# EAGLE schematic Wire Schematic (EAGLE 9.6.2)
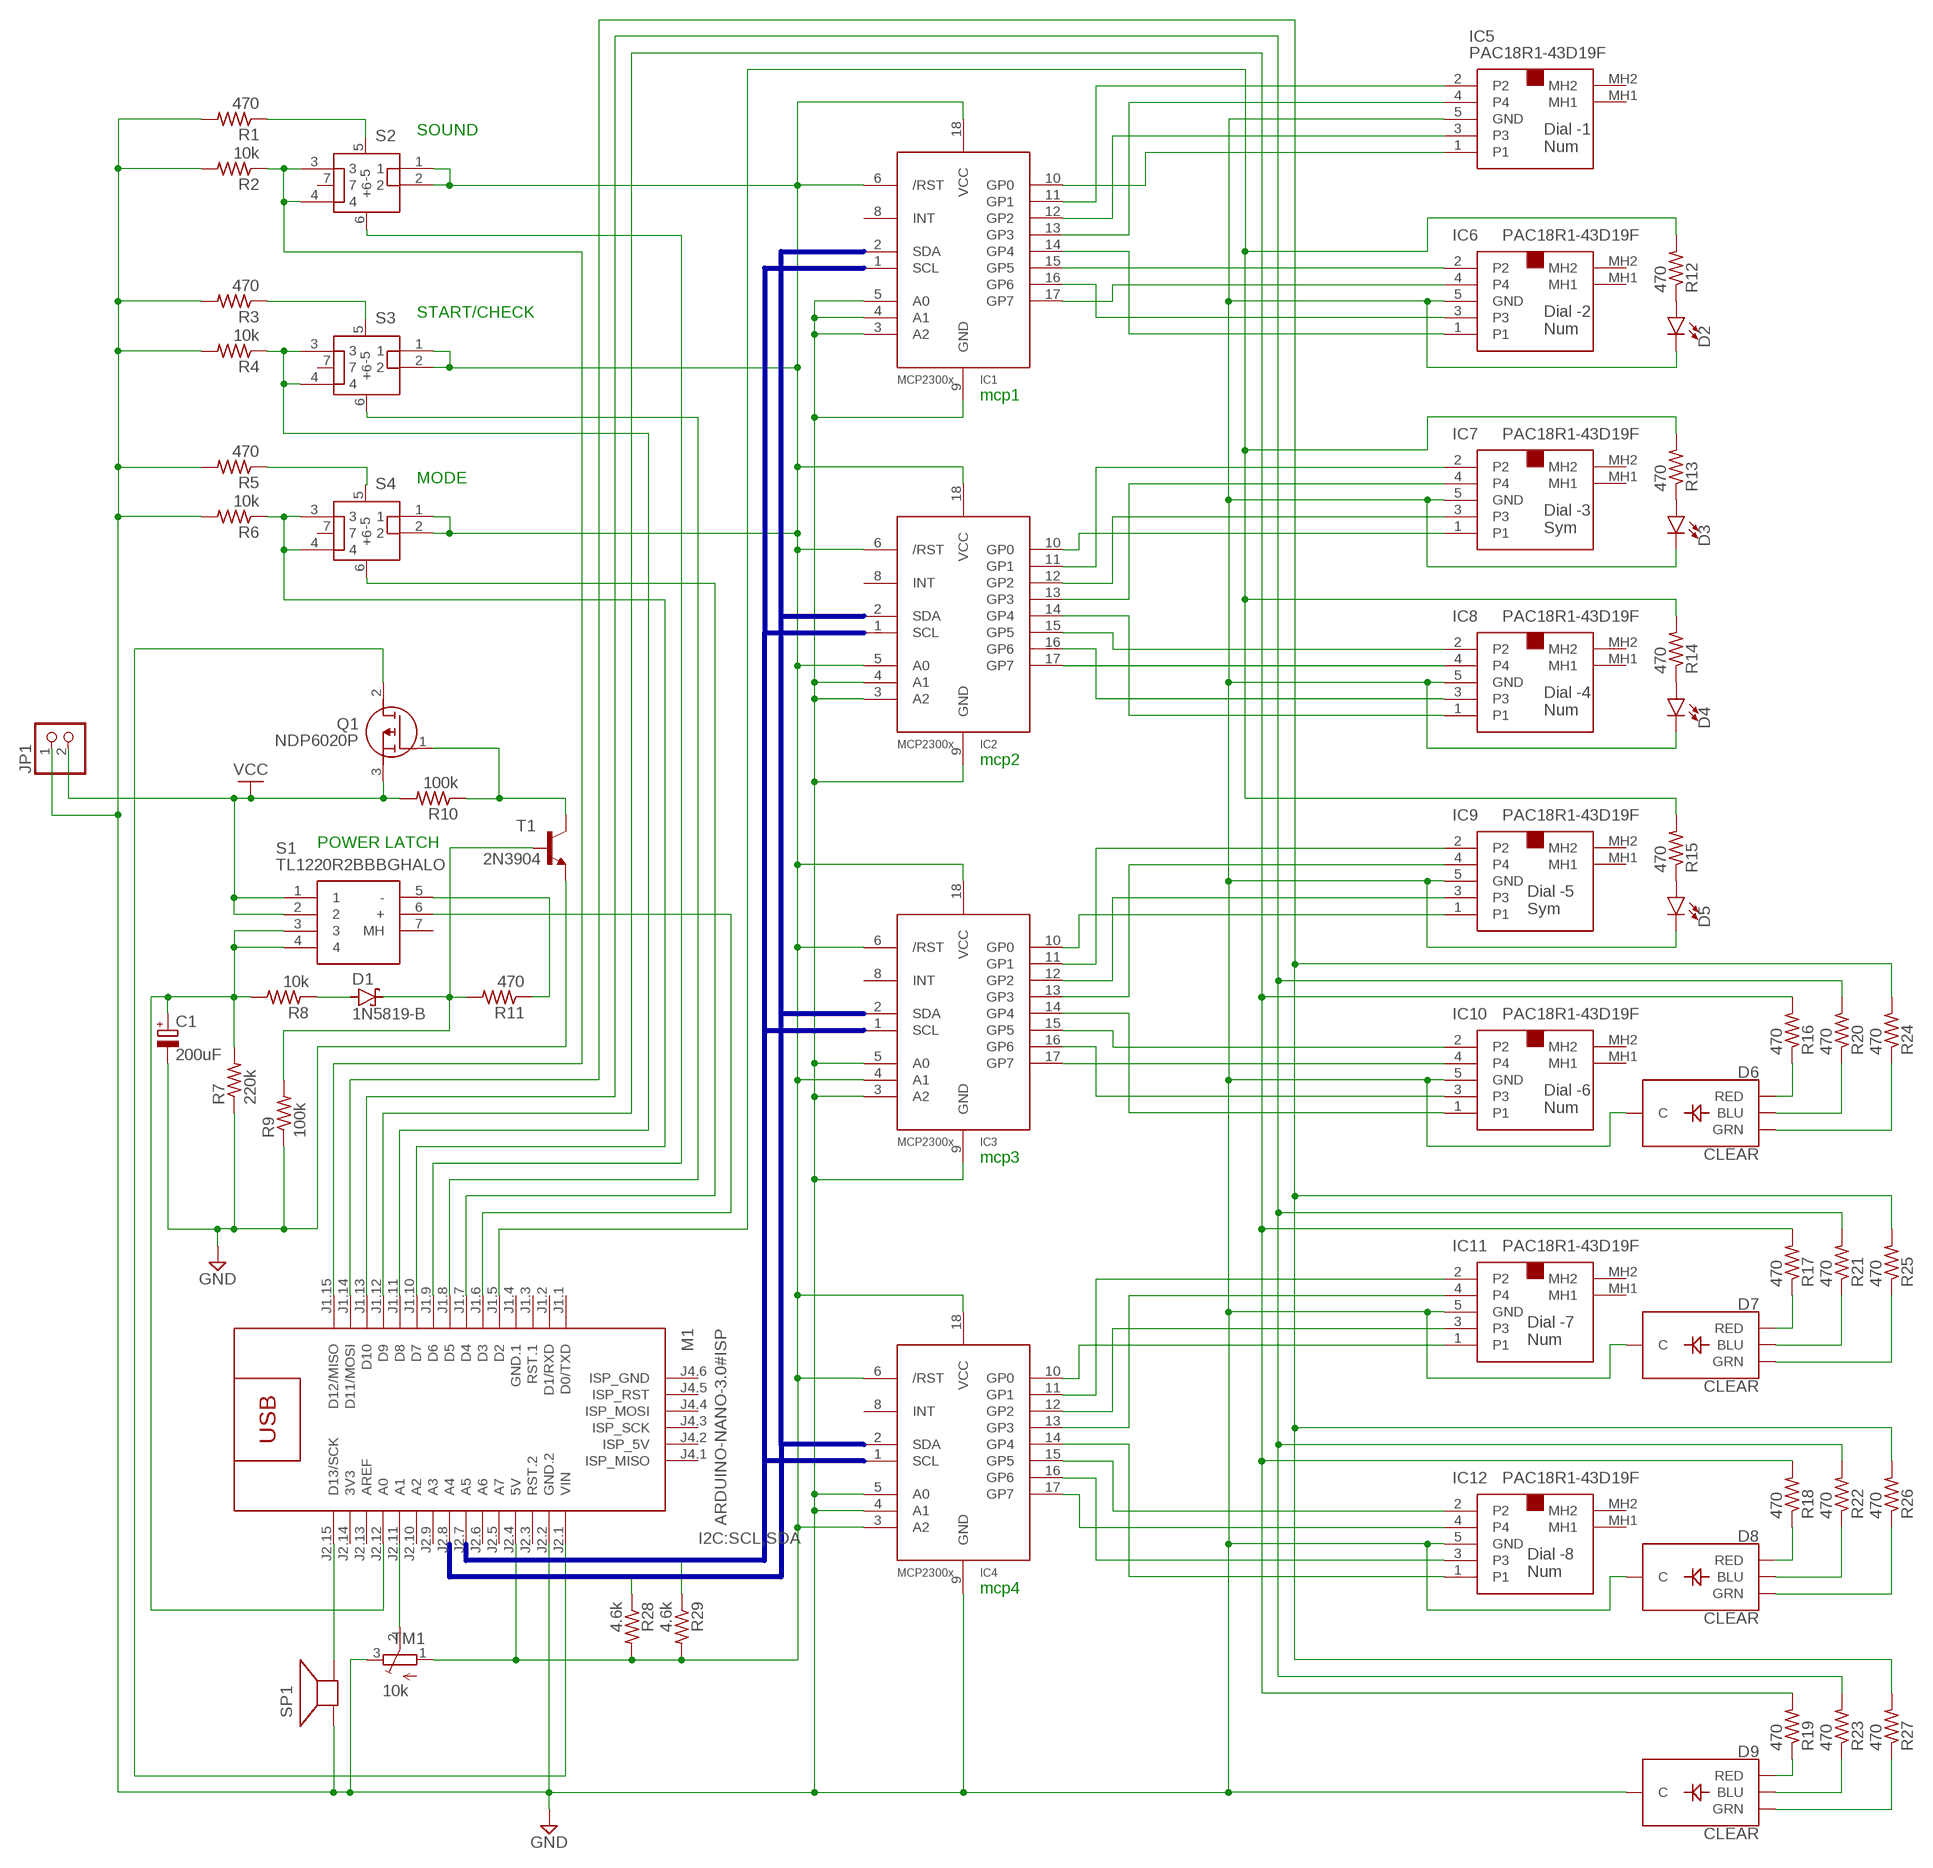
[diagram p0: schematic, sheet 1]

## Parts
C1  200uF  CPOL-EUE2.5-7  [E2,5-7]
D1  1N5819-B  [DO41-7.6]
D2  LED5MM  [LED_5MM]
D3  LED5MM  [LED_5MM]
D4  LED5MM  [LED_5MM]
D5  LED5MM  [LED_5MM]
D6  CLEAR  LED-RGB-CCCLEAR  [LED-RGB-THRU]
D7  CLEAR  LED-RGB-CCCLEAR  [LED-RGB-THRU]
D8  CLEAR  LED-RGB-CCCLEAR  [LED-RGB-THRU]
D9  CLEAR  LED-RGB-CCCLEAR  [LED-RGB-THRU]
IC1  MCP23008/P  [DIL18]
IC2  MCP23008/P  [DIL18]
IC3  MCP23008/P  [DIL18]
IC4  MCP23008/P  [DIL18]
IC5  PAC18R1-43D19F  [PAC18R141D19F]
IC6  PAC18R1-43D19F  [PAC18R141D19F]
IC7  PAC18R1-43D19F  [PAC18R141D19F]
IC8  PAC18R1-43D19F  [PAC18R141D19F]
IC9  PAC18R1-43D19F  [PAC18R141D19F]
IC10  PAC18R1-43D19F  [PAC18R141D19F]
IC11  PAC18R1-43D19F  [PAC18R141D19F]
IC12  PAC18R1-43D19F  [PAC18R141D19F]
JP1  PINHD-1X2  [1X02]
M1  ARDUINO-NANO-3.0#ISP  [ARDUINO-NANO-3.0#ISP]
Q1  NDP6020P  [TO254P470X1016X2019-3P]
R1  470  R-US_0204/5  [0204/5]
R2  10k  R-US_0204/5  [0204/5]
R3  470  R-US_0204/5  [0204/5]
R4  10k  R-US_0204/5  [0204/5]
R5  470  R-US_0204/5  [0204/5]
R6  10k  R-US_0204/5  [0204/5]
R7  220k  R-US_0204/5  [0204/5]
R8  10k  R-US_0204/5  [0204/5]
R9  100k  R-US_0204/5  [0204/5]
R10  100k  R-US_0204/5  [0204/5]
R11  470  R-US_0204/5  [0204/5]
R12  470  R-US_0204/5  [0204/5]
R13  470  R-US_0204/5  [0204/5]
R14  470  R-US_0204/5  [0204/5]
R15  470  R-US_0204/5  [0204/5]
R16  470  R-US_0204/5  [0204/5]
R17  470  R-US_0204/5  [0204/5]
R18  470  R-US_0204/5  [0204/5]
R19  470  R-US_0204/5  [0204/5]
R20  470  R-US_0204/5  [0204/5]
R21  470  R-US_0204/5  [0204/5]
R22  470  R-US_0204/5  [0204/5]
R23  470  R-US_0204/5  [0204/5]
R24  470  R-US_0204/5  [0204/5]
R25  470  R-US_0204/5  [0204/5]
R26  470  R-US_0204/5  [0204/5]
R27  470  R-US_0204/5  [0204/5]
R28  4.6k  R-US_0204/5  [0204/5]
R29  4.6k  R-US_0204/5  [0204/5]
S1  TL1220R2BBBGHALO  [TL1220R2BBBGHALO]
S2  TL1220R2BBBBHALO  [TL1220R2BBBBHALO]
S3  TL1220R2BBBBHALO  [TL1220R2BBBBHALO]
S4  TL1220R2BBBBHALO  [TL1220R2BBBBHALO]
SP1  SPEAKER/AL60P  [AL60P]
T1  2N3904  [TO92]
TM1  10k  TRIMPOT3386  [TRIM-3386]

## Nets
GND: C1.- D2.K(C) D3.K(C) D4.K(C) D5.K(C) D6.2(C) D7.2(C) D8.2(C) D9.2(C) IC1.3(A2) IC1.4(A1) IC1.5(A0) IC1.9(GND) IC2.3(A2) IC2.4(A1) IC2.9(GND) IC3.3(A2) IC3.5(A0) IC3.9(GND) IC4.4(A1) IC4.5(A0) IC4.9(GND) IC5.5(GND) IC6.5(GND) IC7.5(GND) IC8.5(GND) IC9.5(GND) IC10.5(GND) IC11.5(GND) IC12.5(GND) JP1.1 M1.J2.2(GND.2) R1.2 R2.2 R3.2 R4.2 R5.2 R6.2 R7.1 R9.1 SP1.1(+) T1.3(E) TM1.3(E)
N$1: IC1.11(GP1) IC5.2
N$2: IC1.10(GP0) IC5.1
N$3: IC1.13(GP3) IC5.4
N$4: IC1.12(GP2) IC5.3
N$5: IC1.17(GP7) IC6.4
N$6: M1.J2.1(VIN) Q1.2(D)
N$7: M1.J2.11(A1) TM1.2(S)
N$8: IC1.14(GP4) IC6.1
N$9: IC3.15(GP5) IC10.2
N$10: IC1.15(GP5) IC6.2
N$11: IC1.16(GP6) IC6.3
N$12: IC2.14(GP4) IC8.1
N$13: IC2.15(GP5) IC8.2
N$14: IC2.16(GP6) IC8.3
N$15: IC2.11(GP1) IC7.2
N$17: IC2.13(GP3) IC7.4
N$18: IC1.6(/RST) IC1.18(VCC) IC2.5(A0) IC2.6(/RST) IC2.18(VCC) IC3.4(A1) IC3.6(/RST) IC3.18(VCC) IC4.3(A2) IC4.6(/RST) IC4.18(VCC) M1.J2.4(5V) R28.2 R29.2 S2.1 S2.2 S3.1 S3.2 S4.1 S4.2 TM1.1(A)
N$19: IC2.10(GP0) IC7.1
N$20: IC2.12(GP2) IC7.3
N$21: IC2.17(GP7) IC8.4
N$22: M1.J1.11(D8) R4.1 S3.3 S3.4
N$23: IC3.14(GP4) IC10.1
N$24: M1.J1.13(D10) R20.2 R21.2 R22.2 R23.2
N$25: IC3.16(GP6) IC10.3
N$26: IC3.11(GP1) IC9.2
N$27: IC3.13(GP3) IC9.4
N$28: R11.1 S1.5(-)
N$29: IC3.10(GP0) IC9.1
N$30: IC3.12(GP2) IC9.3
N$31: IC3.17(GP7) IC10.4
N$32: M1.J1.8(D5) S3.6(+6)
N$33: M1.J1.6(D3) S1.6(+)
N$34: IC4.14(GP4) IC12.1
N$35: IC4.15(GP5) IC12.2
N$36: IC4.16(GP6) IC12.3
N$37: IC4.11(GP1) IC11.2
N$38: IC4.13(GP3) IC11.4
N$39: D1.A R8.1
N$40: IC4.10(GP0) IC11.1
N$41: IC4.12(GP2) IC11.3
N$42: IC4.17(GP7) IC12.4
N$44: M1.J1.9(D6) S2.6(+6)
N$45: Q1.1(G) R10.1 T1.1(C)
N$46: M1.J1.7(D4) S4.6(+6)
N$47: D3.A R13.1
N$48: D4.A R14.1
N$49: C1.+ M1.J2.12(A0) R7.2 R8.2 S1.3 S1.4
N$51: D5.A R15.1
N$52: M1.J1.5(D2) R12.2 R13.2 R14.2 R15.2
N$53: D1.C R9.2 R11.2 T1.2(B)
N$55: M1.J1.12(D9) R16.2 R17.2 R18.2 R19.2
N$56: M1.J2.15(D13/SCK) SP1.2(-)
N$61: D6.1(RED) R16.1
N$64: D6.4(BLU) R20.1
N$65: M1.J1.10(D7) R6.1 S4.3 S4.4
N$66: D2.A R12.1
N$67: D6.3(GRN) R24.1
N$68: R5.1 S4.5(-5)
N$70: R3.1 S3.5(-5)
N$71: R1.1 S2.5(-5)
N$72: M1.J1.15(D12/MISO) R2.1 S2.3 S2.4
N$80: D7.1(RED) R17.1
N$81: D7.4(BLU) R21.1
N$82: D7.3(GRN) R25.1
N$86: D8.1(RED) R18.1
N$87: D8.4(BLU) R22.1
N$88: D8.3(GRN) R26.1
N$90: M1.J1.14(D11/MOSI) R24.2 R25.2 R26.2 R27.2
N$92: D9.1(RED) R19.1
N$93: D9.4(BLU) R23.1
N$94: D9.3(GRN) R27.1
SCL: R29.1
SDA: R28.1
VCC: JP1.2 Q1.3(S) R10.2 S1.1 S1.2
Unconnected: IC1.1(SCL) IC1.2(SDA) IC1.8(INT) IC2.1(SCL) IC2.2(SDA) IC2.8(INT) IC3.1(SCL) IC3.2(SDA) IC3.8(INT) IC4.1(SCL) IC4.2(SDA) IC4.8(INT) IC5.MH1 IC5.MH2 IC6.MH1 IC6.MH2 IC7.MH1 IC7.MH2 IC8.MH1 IC8.MH2 IC9.MH1 IC9.MH2 IC10.MH1 IC10.MH2 IC11.MH1 IC11.MH2 IC12.MH1 IC12.MH2 M1.J1.1(D0/TXD) M1.J1.2(D1/RXD) M1.J1.3(RST.1) M1.J2.3(RST.2) M1.J2.5(A7) M1.J2.6(A6) M1.J2.7(A5) M1.J2.8(A4) M1.J2.9(A3) M1.J2.10(A2) M1.J2.13(AREF) M1.J4.1(ISP_MISO) M1.J4.2(ISP_5V) M1.J4.3(ISP_SCK) M1.J4.4(ISP_MOSI) M1.J4.5(ISP_RST) M1.J4.6(ISP_GND) S1.7(MH) S2.7 S3.7 S4.7

## Buses
I2C:SCL,SDA

## Notes on the sheet
- SOUND
- Dial -1
  Num
- START/CHECK
- Dial -2
  Num
- mcp1
- MODE
- Dial -3
  Sym
- Dial -4
  Num
- mcp2
- POWER LATCH
- Dial -5
  Sym
- Dial -6
  Num
- mcp3
- Dial -7
  Num
- Dial -8
  Num
- mcp4

## Power pins joined to a net without a drawn wire
3V3: M1.J2.14(3V3)
GND.1: M1.J1.4(GND.1)

## Library data of the parts
C1 = rcl:CPOL-EU: POLARIZED CAPACITOR, European symbol; SPICEPREFIX: C
D1 = diode:1N581*: 1.0A SCHOTTKY BARRIER RECTIFIER Source: http://www.diodes.com/datasheets/ds23001.pdf
D2-D5 = SparkFun-LED:LED: LED (Generic) Standard schematic elements and footprints for 5mm, 3mm, 1206, and 0603 sized LEDs. Generic LEDs with no color specified.
D6-D9 = SparkFun-LED:LED-RGB-CC: LED-RGB Common Cathode Packages: LED RGB-THRU LED_PIRANHA_5MM SparkFun Products: RGB Diffused Common Cathode- Diffuse <[https://www.sparkfun.com/products/9264]> RGB Diffused Common Cathode - Clear <[https://www.sparkfun.com/products/105]> LED-RGB 5mm Square (Piranha) <[https://www.sparkfun.com/products/11679]>; PROD_ID: DIO-08418
IC1-IC4 = adafruit:MCP23008: MCP23008 Inexpensive i2c i/o expander - 8 general purpose i/o pins with optional pullups
IC5-IC12 = Gregs:PAC18R1-43D19F: 18 mm Low Profile Absolute Encoder Source: Datasheet <https://media.digikey.com/pdf/Data Sheets/Bourns PDFs/PAC18R_Series_DS.pdf>; DESCRIPTION: 18 mm Low Profile Absolute Encoder; HEIGHT: 29.2mm; MANUFACTURER_NAME: Bourns; MANUFACTURER_PART_NUMBER: PAC18R1-43D19F; MOUSER_PART_NUMBER: 652-PAC18R1-43D19F; MOUSER_PRICE-STOCK: https://www.mouser.co.uk/ProductDetail/Bourns/PAC18R1-43D19F?qs=IS%252B4QmGtzzoiPnRwlkZJXA%3D%3D
JP1 = pinhead:PINHD-1X2: PIN HEADER
M1 = diy-modules:ARDUINO-NANO-3.0#ISP: Arduino Nano 3.0 with ISP pads
Q1 = SamacSys_Parts:NDP6020P: P-Channel MOSFET, 24 A, 20 V, 3-Pin TO-220 ON Semiconductor NDP6020P Source: Datasheet <https://www.onsemi.com/pub/Collateral/NDP6020P-D.PDF>; DESCRIPTION: P-Channel MOSFET, 24 A, 20 V, 3-Pin TO-220 ON Semiconductor NDP6020P; HEIGHT: 4.7mm; MANUFACTURER_NAME: ON Semiconductor; MANUFACTURER_PART_NUMBER: NDP6020P; MOUSER_PART_NUMBER: 512-NDP6020P; MOUSER_PRICE-STOCK: https://www.mouser.co.uk/ProductDetail/ON-Semiconductor-Fairchild/NDP6020P?qs=mdiO5HdF0Khl%252BuaDKGopOw%3D%3D
R1-R29 = adafruit:R-US_: RESISTOR, American symbol
S1 = SamacSys_Parts:TL1220R2BBBGHALO: Illuminated Tactile Switches Illuminated Multi-Option Tact Switch 50mA 12VDC 100m @ 1.5 VDC Max -40 C to 85 C 180 gf 50gf SPST 8.0mm dia button with black bezel, black button, Green LED Halo Source: Datasheet; DESCRIPTION: Illuminated Tactile Switches Illuminated Multi-Option Tact Switch 50mA 12VDC 100m @ 1.5 VDC Max -40 C to 85 C 180 gf 50gf SPST 8.0mm dia button with black bezel, black button, Green LED Halo; HEIGHT: 9mm; MANUFACTURER_NAME: E-Switch; MANUFACTURER_PART_NUMBER: TL1220R2BBBGHALO; MOUSER_PART_NUMBER: 612-TL1220R2BBBGHALO; MOUSER_PRICE-STOCK: https://www.mouser.co.uk/ProductDetail/E-Switch/TL1220R2BBBGHALO?qs=xQzBpF%2FAFTopKldGf8o7KQ%3D%3D
S2-S4 = Gregs:TL1220R2BBBBHALO: Tactile Switches Illuminated Multi-Option Tact Switch 50mA 12VDC 100m @ 1.5 VDC Max -40 C to 85 C 180 gf 50gf SPST 8.0mm dia button with black bezel, black button, Blue LED Halo Source: Datasheet <https://componentsearchengine.com/Datasheets/1/TL1220R2BBBBHALO.pdf>; DESCRIPTION: Tactile Switches Illuminated Multi-Option Tact Switch 50mA 12VDC 100m @ 1.5 VDC Max -40 C to 85 C 180 gf 50gf SPST 8.0mm dia button with black bezel, black button, Blue LED Halo; HEIGHT: 9.9mm; MANUFACTURER_NAME: E-Switch; MANUFACTURER_PART_NUMBER: TL1220R2BBBBHALO; MOUSER_PART_NUMBER: 612-TL1220R2BBBBHALO; MOUSER_PRICE-STOCK: https://www.mouser.co.uk/ProductDetail/E-Switch/TL1220R2BBBBHALO/?qs=xQzBpF%2FAFTqtthic0z3ctg%3D%3D
SP1 = adafruit:SPEAKER: SPEAKER Source: Buerklin Added PS12 (for part # PS1240 piezo) http://www.ladyada.net/library/pcb/eaglelibrary.html
T1 = transistor:2N3904: NPN TRANSISTOR
TM1 = adafruit:TRIMPOT: SMT trimmer potentiometer part number TC33X http://www.ladyada.net/library/eagle